# Altium schematic sheet AUDIO.SchDoc: RasPiCompute_AUDIO
size B; Engineer: Benjamin Beaudoin; Revision: v0.1
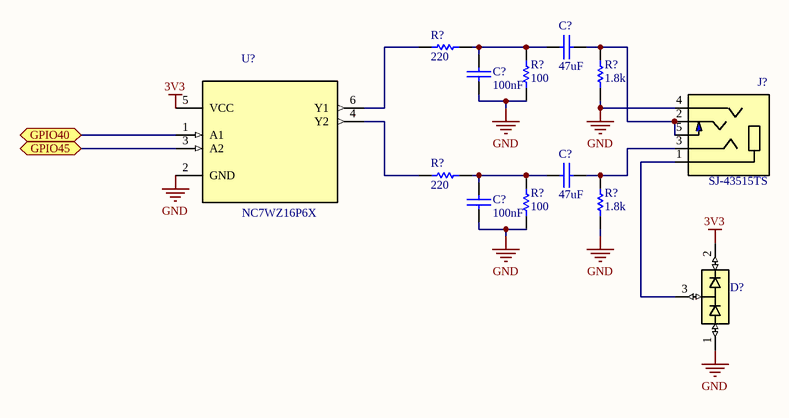
[diagram p0: AUDIO.SchDoc]

## Parts
(Parts that share a designator on the sheet are numbered #1, #2 ... from top to bottom, then left to right.)
C?#1  47uF  [0402C]
C?#2  100nF  [0402C]
C?#3  47uF  [0402C]
C?#4  100nF  [0402C]
D?  BAV99  [SOT23-3]  (value not drawn)
J?  SJ-43515TS  [CUI_SJ-43515TS]
R?#1  220  [0402C]
R?#2  100  [0402C]
R?#3  1.8k  [0402C]
R?#4  220  [0402C]
R?#5  100  [0402C]
R?#6  1.8k  [0402C]
U?  NC7WZ16P6X  [SOT65P210X110-6N]

## Ports
GPIO40, GPIO45

## Nets
3V3: D?.2(C2) U?.5(VCC)
GND: C?#2.1 C?#4.1 D?.1(A1) J?.4(RING2) R?#2.1 R?#3.1 R?#5.1 R?#6.1 U?.2(GND)
GPIO40: U?.1(A1) ; port GPIO40
GPIO45: U?.3(A2) ; port GPIO45
NetC?#1_1: C?#1.1 C?#2.2 R?#1.2 R?#2.2
NetC?#1_2: C?#1.2 J?.2(TIP) J?.5(TIP_SWITCH) R?#3.2
NetC?#3_1: C?#3.1 C?#4.2 R?#4.2 R?#5.2
NetC?#3_2: C?#3.2 J?.3(RING1) R?#6.2
NetD?_3: D?.3(COM) J?.1(SLEEVE)
NetR?#1_1: R?#1.1 U?.6(Y1)
NetR?#4_1: R?#4.1 U?.4(Y2)

## Library data of the parts
C?#1-C?#4 = C: Capacitor; Power_WV_SRF: 25V; MFGPN: *; MFG: *; Tolerance: *; TempCo: *; Distributor: *; CMPN: *
  C?#1 C?#3: Value: 47uF
  C?#2 C?#4: Value: 100nF
D? = BAV99: Diode, Small Signal; 250 mA; 1.25 V _Max._; 300 mW; 430 K/W; 70 V; 6 nS _Max._; MF: ON Semiconductor; SnapEDA_Link: https://www.snapeda.com/parts/BAV99/ON%20Semiconductor/view-part/?ref=snap; Package: SOT-23-3 Vishay; Price: 0.07 USD; Availability: Unavailable; MP: BAV99; Value: *
J? = SJ-43515TS: 4 Conductor PCB Mount Low Profile 3.5 mm Audio Jack; MF: CUI; MP: SJ-43515TS; Package: None; Availability: Good; SnapEDA_Link: https://www.snapeda.com/parts/SJ-43515TS/CUI/view-part/?ref=snap; Price: 0.73 USD; Value: *
R?#1-R?#6 = R: Resistor; Tolerance: 5%; Power_WV_SRF: *; MFG: *; MFGPN: *; Distributor: *; CMPN: *
  R?#1 R?#4: Value: 220
  R?#2 R?#5: Value: 100
  R?#3 R?#6: Value: 1.8k
U? = NC7WZ16P6X: NC7WZ16 Series 5.5 V Surface Mount TinyLogic UHS Dual Buffer - SC-70-6; MF: ON Semiconductor; MP: NC7WZ16P6X; SnapEDA_Link: https://www.snapeda.com/parts/NC7WZ16P6X/ON%20Semiconductor/view-part/?ref=snap; Price: 0.13 USD; Availability: Good; Package: SC-70-6 ON Semiconductor; Value: *